# EAGLE design LDVBug_Hauptplatine (EAGLE 6.5.0)
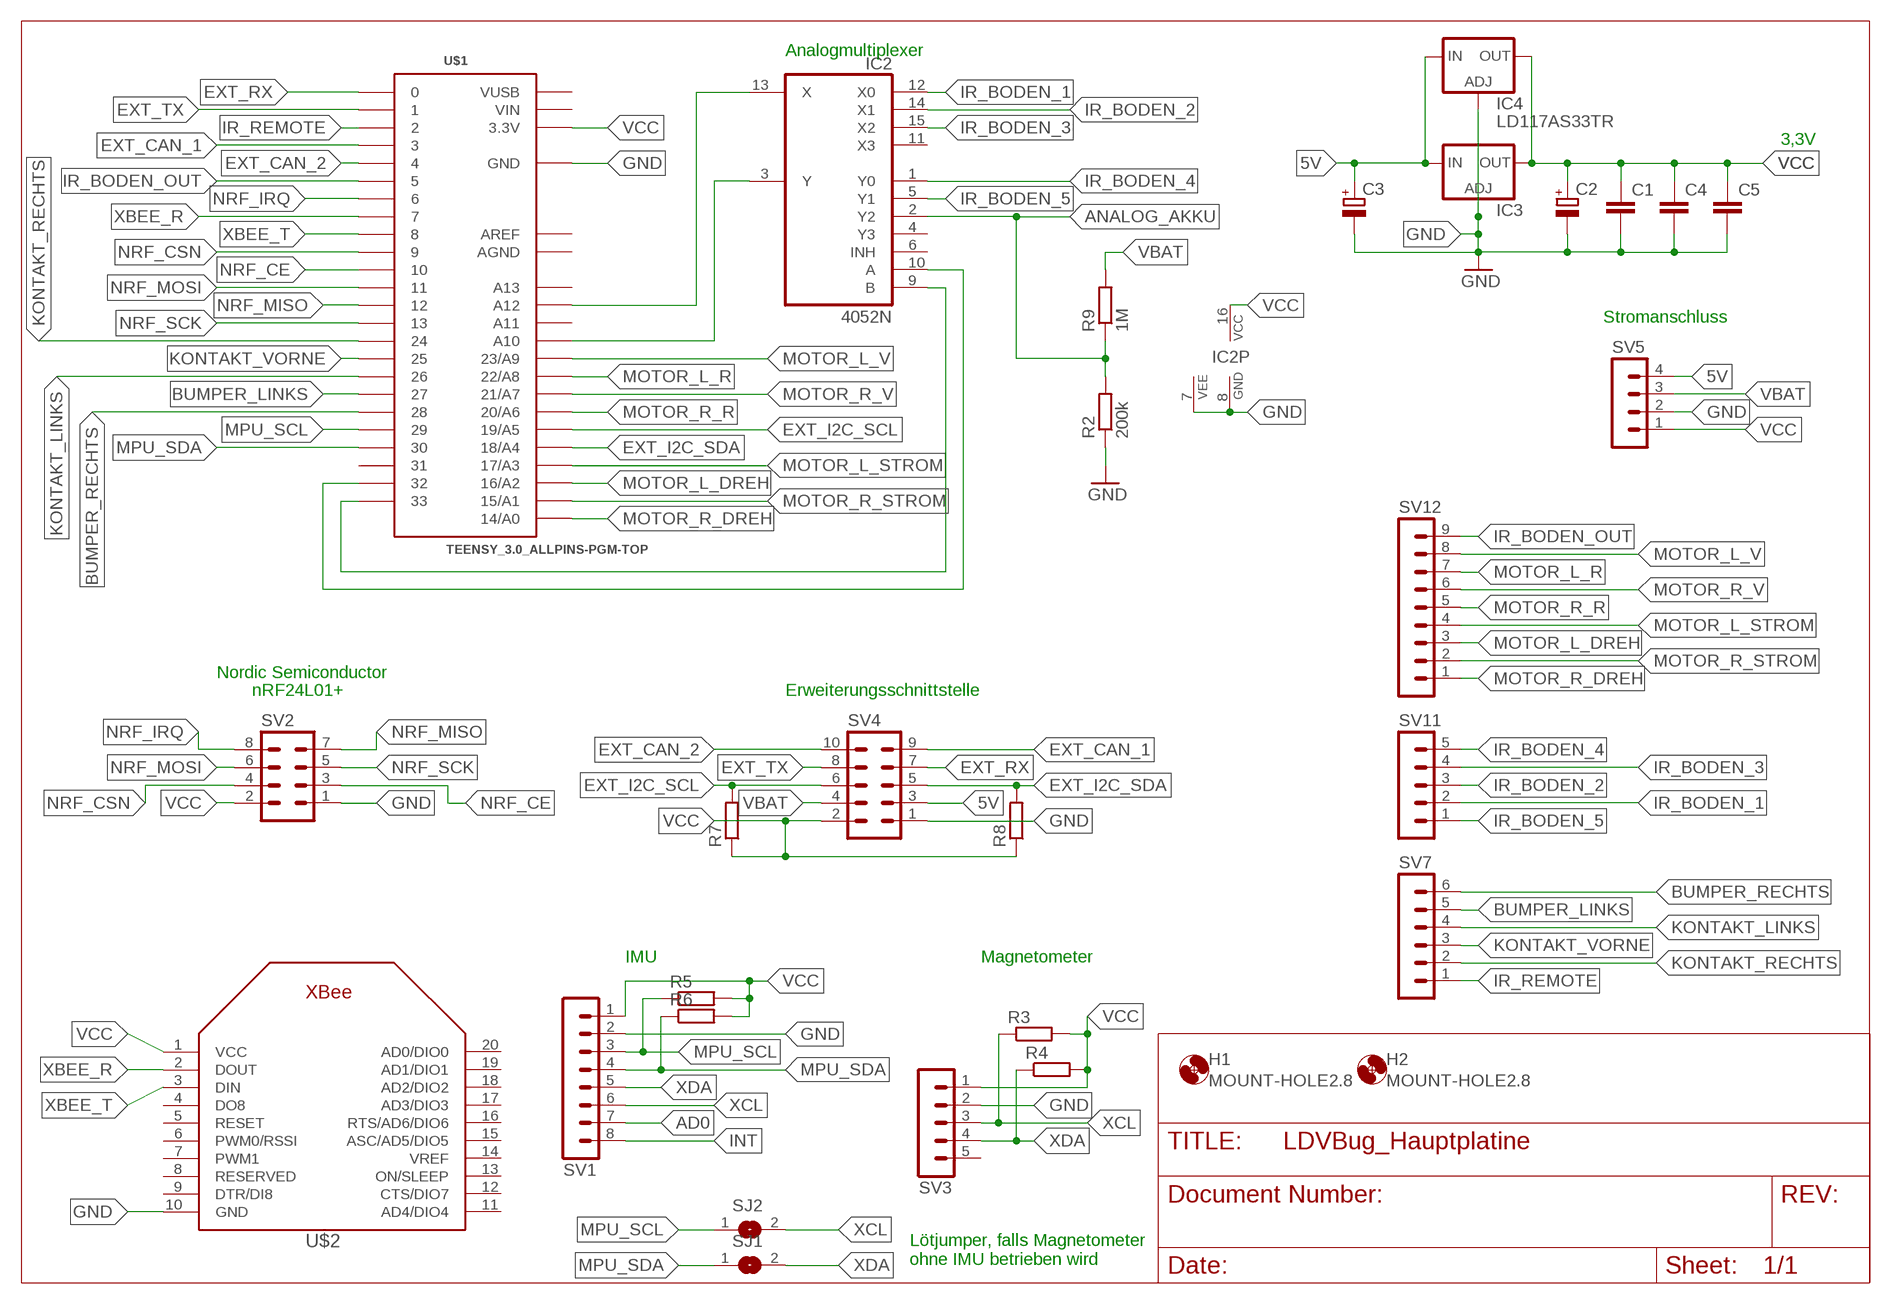
[diagram p0: schematic, sheet 1]

## Parts
C1  C-EU025-025X050  [C025-025X050]
C2  CPOL-EUE2.5-7  [E2,5-7]
C3  CPOL-EUE2.5-7  [E2,5-7]
C4  C-EU025-025X050  [C025-025X050]
C5  C-EU025-025X050  [C025-025X050]
H1  MOUNT-HOLE2.8  [2,8]
H2  MOUNT-HOLE2.8  [2,8]
IC2  4052N  [DIL16]
IC3  LM317TS  [317TS]
IC4  LD117AS33TR  [SOT223]
R2  200k  R-EU_0207/10  [0207/10]
R3  R-EU_R0805  [R0805]
R4  R-EU_R0805  [R0805]
R5  R-EU_R0805  [R0805]
R6  R-EU_R0805  [R0805]
R7  R-EU_R0805  [R0805]
R8  R-EU_R0805  [R0805]
R9  1M  R-EU_0207/18  [0207/15]
SJ1  SJ  [SJ]
SJ2  SJ  [SJ]
SV1  MA08-1  [MA08-1]
SV2  MA04-2  [MA04-2]
SV3  MA05-1  [MA05-1]
SV4  MA05-2  [MA05-2]
SV5  MA04-1  [MA04-1]
SV7  MA06-1  [MA06-1]
SV11  MA05-1  [MA05-1]
SV12  MA09-1  [MA09-1]
U$1  TEENSY_3.0_ALLPINS-PGM-TOP  [TEENSY_3.0_ALLPINS-PGM]
U$2  XBEE  [XBEE]

## Nets
5V: C3.+ IC3.3(IN) IC4.3(IN) SV4.3 SV5.4
AD0: SV1.7
ANALOG_AKKU: IC2.2(Y2) R2.2 R9.1
BUMPER_LINKS: SV7.5 U$1.27
BUMPER_RECHTS: SV7.6 U$1.28
EXT_CAN_1: SV4.9 U$1.3
EXT_CAN_2: SV4.10 U$1.4
EXT_I2C_SCL: R7.2 SV4.6 U$1.19/A5
EXT_I2C_SDA: R8.2 SV4.5 U$1.18/A4
EXT_RX: SV4.7 U$1.0
EXT_TX: SV4.8 U$1.1
GND: C1.2 C2.- C3.- C4.2 C5.2 IC2.7(VEE) IC2.8(GND) IC3.1(ADJ) IC4.1(ADJ) R2.1 SV1.2 SV2.1 SV3.2 SV4.1 SV5.2 U$1.GND U$1.GND2(GND) U$2.10(GND)
INT: SV1.8
IR_BODEN_1: IC2.12(X0) SV11.2
IR_BODEN_2: IC2.14(X1) SV11.3
IR_BODEN_3: IC2.15(X2) SV11.4
IR_BODEN_4: IC2.1(Y0) SV11.5
IR_BODEN_5: IC2.5(Y1) SV11.1
IR_BODEN_OUT: SV12.9 U$1.5
IR_REMOTE: SV7.1 U$1.2
KONTAKT_LINKS: SV7.4 U$1.26
KONTAKT_RECHTS: SV7.2 U$1.24
KONTAKT_VORNE: SV7.3 U$1.25
MOTOR_L_DREH: SV12.3 U$1.16/A2
MOTOR_L_R: SV12.7 U$1.22/A8
MOTOR_L_STROM: SV12.4 U$1.17/A3
MOTOR_L_V: SV12.8 U$1.23/A9
MOTOR_R_DREH: SV12.1 U$1.14/A0
MOTOR_R_R: SV12.5 U$1.20/A6
MOTOR_R_STROM: SV12.2 U$1.15/A1
MOTOR_R_V: SV12.6 U$1.21/A7
MPU_SCL: R5.1 SJ2.1 SV1.3 U$1.29
MPU_SDA: R6.1 SJ1.1 SV1.4 U$1.30
N$2: IC2.13(X) U$1.A12
N$3: IC2.3(Y) U$1.A10
N$4: IC2.9(B) U$1.33
N$5: IC2.10(A) U$1.32
NRF_CE: SV2.3 U$1.10
NRF_CSN: SV2.4 U$1.9
NRF_IRQ: SV2.8 U$1.6
NRF_MISO: SV2.7 U$1.12
NRF_MOSI: SV2.6 U$1.11
NRF_SCK: SV2.5 U$1.13
VBAT: R9.2 SV4.4 SV5.3
VCC: C1.1 C2.+ C4.1 C5.1 IC2.16(VCC) IC3.2(OUT) IC4.4(OUT) R3.2 R4.2 R5.2 R6.2 R7.1 R8.1 SV1.1 SV2.2 SV3.1 SV4.2 SV5.1 U$1.3.3V U$1.3.3V2(3.3V) U$2.1(VCC)
XBEE_R: U$1.7 U$2.2(DOUT)
XBEE_T: U$1.8 U$2.3(DIN)
XCL: R3.1 SJ2.2 SV1.6 SV3.3
XDA: R4.1 SJ1.2 SV1.5 SV3.4
Unconnected: IC2.4(Y3) IC2.6(INH) IC2.11(X3) SV3.5 U$1.31 U$1.A11 U$1.A13 U$2.4(DO8) U$2.5(RESET) U$2.6(PWM0/RSSI) U$2.7(PWM1) U$2.8(RESERVED) U$2.9(DTR/DI8) U$2.11(AD4/DIO4) U$2.12(CTS/DIO7) U$2.13(ON/SLEEP) U$2.14(VREF) U$2.15(ASC/AD5/DIO5) U$2.16(RTS/AD6/DIO6) U$2.17(AD3/DIO3) U$2.18(AD2/DIO2) U$2.19(AD1/DIO1) U$2.20(AD0/DIO0)

## Notes on the sheet
- Analogmultiplexer
- 3,3V
- Stromanschluss
- Nordic Semiconductor
- nRF24L01+ | Erweiterungsschnittstelle
- IMU | Magnetometer
- Lötjumper, falls Magnetometer
  ohne IMU betrieben wird

## Power pins joined to a net without a drawn wire
AGND: U$1.AGND
AREF: U$1.AREF
VIN: U$1.VIN
VUSB: U$1.VUSB

## Library data of the parts
C1 C4 C5 = resistor:C-EU: CAPACITOR, European symbol
C2 C3 = resistor:CPOL-EU: POLARIZED CAPACITOR, European symbol
H1 H2 = holes:MOUNT-HOLE: MOUNTING HOLE with drill center marker
IC2 = 40xx:4052: Dual 4-channel ANALOG MULTIPLEXER
IC3 = v-reg:LM317TS: VOLTAGE REGULATOR
IC4 = v-reg:LD117A?*: Low drop fixed and adjustable positive voltage regulators 1 A Source: http://www.st.com/stonline/products/literature/ds/7194/ld1117axx.pdf
R2-R8 = resistor:R-EU_: RESISTOR, European symbol
R9 = resistor_alex:R-EU_: RESISTOR, European symbol
SJ1 SJ2 = jumper:SJ: SMD solder JUMPER
SV1 = con-lstb:MA08-1: PIN HEADER; OC_FARNELL: unknown; OC_NEWARK: unknown
SV2 = con-lstb:MA04-2: PIN HEADER; OC_FARNELL: unknown; OC_NEWARK: unknown
SV3 SV11 = con-lstb:MA05-1: PIN HEADER; OC_FARNELL: unknown; OC_NEWARK: unknown
SV4 = con-lstb:MA05-2: PIN HEADER; OC_FARNELL: unknown; OC_NEWARK: unknown
SV5 = con-lstb:MA04-1: PIN HEADER; OC_FARNELL: unknown; OC_NEWARK: unknown
SV7 = con-lstb:MA06-1: PIN HEADER; OC_FARNELL: unknown; OC_NEWARK: unknown
SV12 = con-lstb:MA09-1: PIN HEADER; OC_FARNELL: unknown; OC_NEWARK: unknown
U$1 = Teensy3.1:TEENSY_3.0_ALLPINS-PGM-TOP: Teensy 3.0 board outline with all pins and pads enabled except 'PGM' pin. For more basic versions, see 'Basic', '+4', and 'AllAnalogPins'. Requires the installation of a un-shrouded SMD header on the underside of the Teensy 3.0
U$2 = adafruit:XBEE

## Board
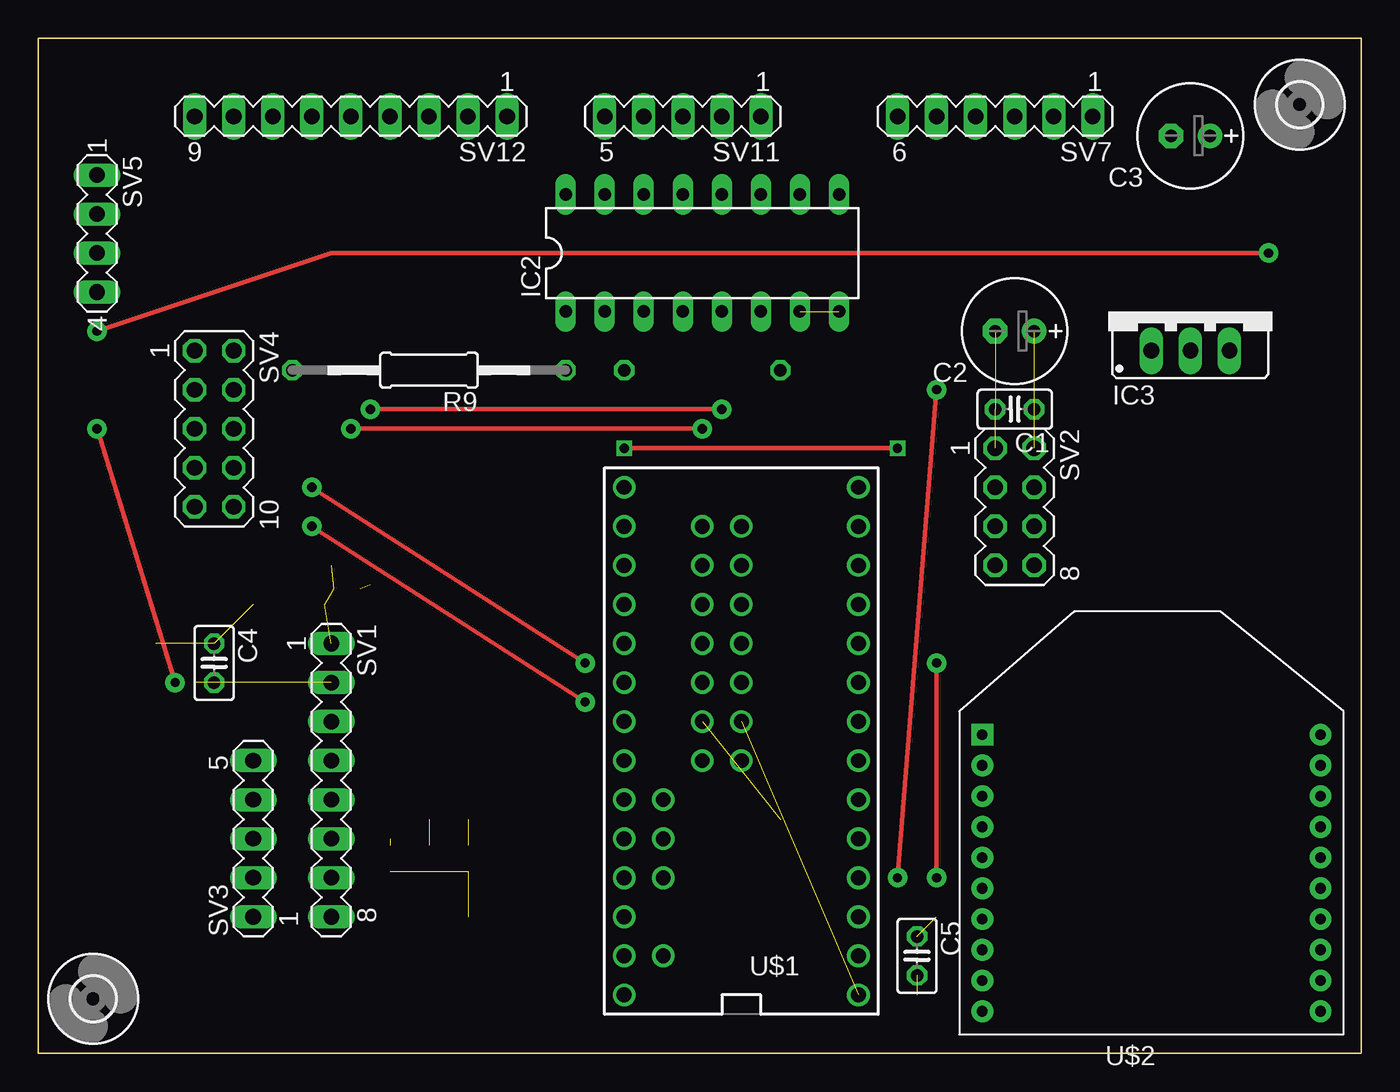
[diagram p1: board, top side]
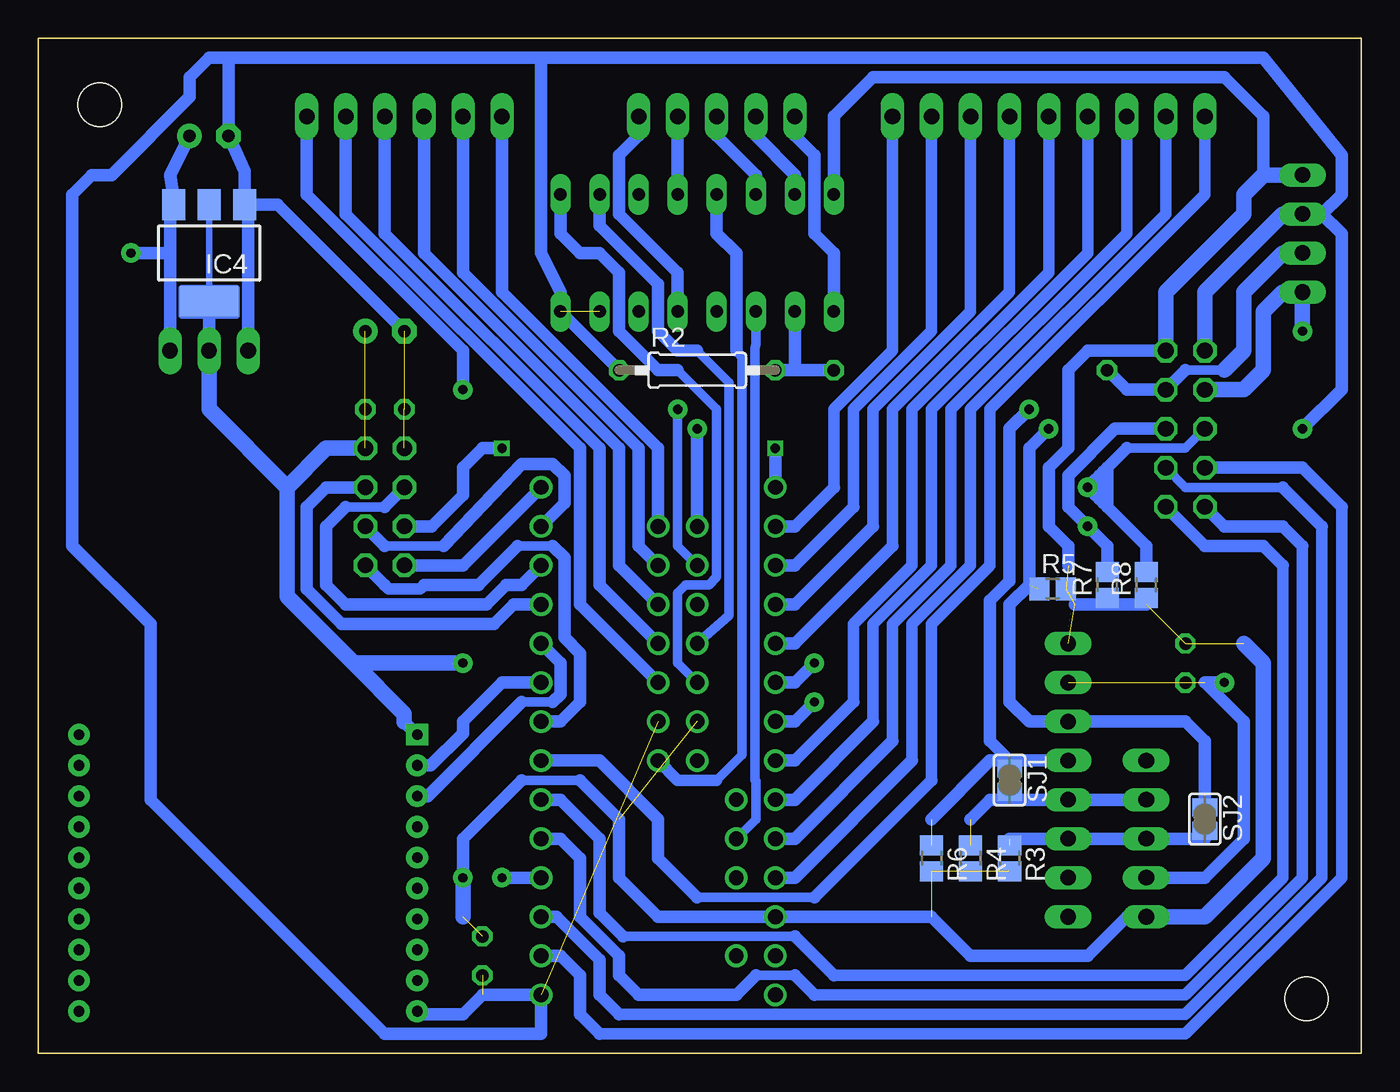
[diagram p2: board, bottom side, seen from below]

Size 86.03 x 66.03 mm. Coordinates in mm from the lower left corner, seen from the top.
Outline: 0,0 86.03,0 86.03,66.03 0,66.03 0,0
Copper layers (1*16): Top 0.035mm / dielectric 1.5mm / Bottom 0.035mm
Design rules "default": minimum track width 10mil, minimum drill 24mil, track to track 8mil, track to pad 8mil, pad to pad 8mil, via to via 8mil, smd to smd 8mil, copper to edge 40mil, drill to drill 8mil, minimum pad ring 10mil, minimum via ring 8mil, stop-mask expansion 4mil, vias tented up to drill 0mil, thermal gap 10mil
bRestrict: area 32.3,49.3 to 32.8,49.8

### Footprints (pad centres in the part's own frame; a part is rotated, then mirrored left to right if it is on the bottom)
C025-025X050 = drill 0.813 octagon: 1 -1.27,0; 2 1.27,0
E2,5-7 = drill 0.813 pad 1.6: + -1.27,0 | drill 0.813 pad 1.6 octagon: - 1.27,0
2,8 = hole 2.8: 0,0
DIL16 = drill 0.813 long: 1 -8.89,-3.81; 2 -6.35,-3.81; 3 -3.81,-3.81; 4 -1.27,-3.81; 5 1.27,-3.81; 6 3.81,-3.81; 7 6.35,-3.81; 8 8.89,-3.81; 9 8.89,3.81; 10 6.35,3.81; 11 3.81,3.81; 12 1.27,3.81; 13 -1.27,3.81; 14 -3.81,3.81; 15 -6.35,3.81; 16 -8.89,3.81
317TS = drill 1.016 long: 1 -2.54,-2.54; 2 0,-2.54; 3 2.54,-2.54
SOT223 = smd 1.5 x 2: 1 -2.3,-3.15; 2 0,-3.15; 3 2.3,-3.15 | smd 3.8 x 2: 4 0,3.15
0207/10 = drill 0.813 octagon: 1 -5.08,0; 2 5.08,0
R0805 = smd 1.3 x 1.5: 1 -0.85,0; 2 0.85,0
0207/15 = drill 0.813 octagon: 1 -8.89,0; 2 8.89,0
SJ = smd 1.168 x 1.6: 1 -0.762,0; 2 0.762,0
MA08-1 = drill 1.016 long: 1 -8.89,0; 2 -6.35,0; 3 -3.81,0; 4 -1.27,0; 5 1.27,0; 6 3.81,0; 7 6.35,0; 8 8.89,0
MA04-2 = drill 1.016 octagon: 1 -3.81,-1.27; 2 -3.81,1.27; 3 -1.27,-1.27; 4 -1.27,1.27; 5 1.27,-1.27; 6 1.27,1.27; 7 3.81,-1.27; 8 3.81,1.27
MA05-1 = drill 1.016 long: 1 -5.08,0; 2 -2.54,0; 3 0,0; 4 2.54,0; 5 5.08,0
MA05-2 = drill 1.016 octagon: 1 -5.08,-1.27; 2 -5.08,1.27; 3 -2.54,-1.27; 4 -2.54,1.27; 5 0,-1.27; 6 0,1.27; 7 2.54,-1.27; 8 2.54,1.27; 9 5.08,-1.27; 10 5.08,1.27
MA04-1 = drill 1.016 long: 1 -3.81,0; 2 -1.27,0; 3 1.27,0; 4 3.81,0
MA06-1 = drill 1.016 long: 1 -6.35,0; 2 -3.81,0; 3 -1.27,0; 4 1.27,0; 5 3.81,0; 6 6.35,0
MA09-1 = drill 1.016 long: 1 -10.16,0; 2 -7.62,0; 3 -5.08,0; 4 -2.54,0; 5 0,0; 6 2.54,0; 7 5.08,0; 8 7.62,0; 9 10.16,0
TEENSY_3.0_ALLPINS-PGM = drill 0.965: 0 -6.35,16.51; 1 -6.35,13.97; 2 -6.35,11.43; 3 -6.35,8.89; 3.3V 8.89,13.97; 3.3V2 3.81,1.27; 4 -6.35,6.35; 5 -6.35,3.81; 6 -6.35,1.27; 7 -6.35,-1.27; 8 -6.35,-3.81; 9 -6.35,-6.35; 10 -6.35,-8.89; 11 -6.35,-11.43; 12 -6.35,-13.97; 13 8.89,-13.97; 14/A0 8.89,-11.43; 15/A1 8.89,-8.89; 16/A2 8.89,-6.35; 17/A3 8.89,-3.81; 18/A4 8.89,-1.27; 19/A5 8.89,1.27; 20/A6 8.89,3.81; 21/A7 8.89,6.35; 22/A8 8.89,8.89; 23/A9 8.89,11.43; 24 1.27,-1.27; 25 1.27,-3.81; 26 1.27,-6.35; 27 1.27,-8.89; 28 1.27,-11.43; 29 3.81,-11.43; 30 3.81,-8.89; 31 3.81,-6.35; 32 3.81,-3.81; 33 3.81,-1.27; A10 6.35,8.89; A11 6.35,6.35; A12 1.27,3.81; A13 3.81,3.81; AGND 8.89,16.51; AREF 6.35,11.43; GND -6.35,19.05; GND2 1.27,1.27; VIN 8.89,19.05; VUSB 6.35,16.51
XBEE = drill 0.7 pad 1.422 square: 1 -11,5.5 | drill 0.7 pad 1.422: 2 -11,3.5; 3 -11,1.5; 4 -11,-0.5; 5 -11,-2.5; 6 -11,-4.5; 7 -11,-6.5; 8 -11,-8.5; 9 -11,-10.5; 10 -11,-12.5; 11 11,-12.5; 12 11,-10.5; 13 11,-8.5; 14 11,-6.5; 15 11,-4.5; 16 11,-2.5; 17 11,-0.5; 18 11,1.5; 19 11,3.5; 20 11,5.5

### Placement (x,y rotation side)
C1  63.5,41.91 180 top
C2  63.5,46.99 180 top
C3  74.93,59.69 180 top
C4  11.43,25.4 270 top
C5  57.15,6.35 270 top
H1  82.04,61.72 0 top
H2  3.56,3.56 0 top
IC2  43.18,52.07 0 top
IC3  74.93,48.26 0 top
IC4  74.93,52.07 180 bottom
R2  43.18,44.45 0 bottom
R3  22.86,12.7 270 bottom
R4  25.4,12.7 270 bottom
R5  20.07,30.23 0 bottom
R6  27.94,12.7 270 bottom
R7  16.51,30.48 90 bottom
R8  13.97,30.48 90 bottom
R9  25.4,44.45 180 top
SJ1  22.86,17.78 270 bottom
SJ2  10.16,15.24 270 bottom
SV1  19.05,17.78 270 top
SV2  63.5,35.56 270 top
SV3  13.97,13.97 90 top
SV4  11.43,40.64 270 top
SV5  3.81,53.34 270 top
SV7  62.23,60.96 180 top
SV11  41.91,60.96 180 top
SV12  20.32,60.96 180 top
U$1  46.99,22.86 180 top
U$2  72.39,15.24 0 top

### Tracks (layer width: path | path; a pad name or v marks a point on that pad's centre or on a via)
5V  (via drill 0.6 pad 1.27)
  Top 0.305: v3.81,46.99 19.05,52.07 v80.01,52.07
  Bottom 0.813: IC3.3 77.47,52.07 | 77.47,52.07 77.47,54.98 IC4.3 77.23,55.64 77.47,57.15 C3.+ | SV4.3 8.89,43.18 | v80.01,52.07 77.47,52.07
  Bottom 1.016: SV4.3 7.62,43.18 6.35,44.45 6.35,48.26 5.08,49.53 SV5.4 v3.81,46.99
ANALOG_AKKU
  Bottom 0.813: IC2.2 36.83,44.45 R2.2 R9.1
BUMPER_LINKS
  Bottom 0.762: 46.99,39.37 58.42,50.8
  Bottom 0.813: U$1.27 46.99,33.02 46.99,39.37 | 58.42,50.8 SV7.5
BUMPER_RECHTS
  Bottom 0.762: 45.72,39.37 55.88,49.53
  Bottom 0.813: U$1.28 45.72,39.37 | 55.88,49.53 SV7.6
EXT_CAN_1
  Bottom 0.61: 39.37,5.08 36.83,5.08
  Bottom 0.762: 35.56,3.81 11.43,3.81 3.81,11.43 3.81,33.02
  Bottom 0.813: U$1.3 52.07,13.97 50.8,12.7 50.8,8.89 48.26,6.35 48.26,5.08 46.99,3.81 40.64,3.81 39.37,5.08 | 36.83,5.08 35.56,3.81 | 3.81,33.02 5.08,34.29 8.89,34.29 SV4.9
EXT_CAN_2
  Bottom 0.61: 48.01,7.62 36.83,7.62
  Bottom 0.762: 34.29,5.08 11.43,5.08 5.08,11.43 5.08,31.75
  Bottom 0.813: U$1.4 52.07,16.51 49.53,13.97 49.53,9.14 48.01,7.62 | 36.83,7.62 34.29,5.08 | 5.08,31.75 6.35,33.02 10.16,33.02 SV4.10
EXT_I2C_SCL  (via drill 0.6 pad 1.27)
  Top 0.305: v35.56,22.86 v17.78,34.29
  Bottom 0.813: SV4.6 16,40.64 19.05,37.59 19.05,35.56 v17.78,34.29 16.51,33.02 R7.2 | U$1.19/A5 36.83,21.59 v35.56,22.86
EXT_I2C_SDA  (via drill 0.6 pad 1.27)
  Top 0.305: v35.56,25.4 v17.78,36.83
  Bottom 0.61: SV4.5 11.43,39.37 15.24,39.37
  Bottom 0.813: R8.2 13.97,33.02 16.51,35.56 | 17.27,36.32 17.27,37.34 | 17.27,37.34 17.02,37.59 | 17.02,37.59 17.02,36.07 | 16.76,35.81 16.76,37.85 | 16.51,38.1 16.51,35.56 | 16.51,35.56 16.76,35.81 | 16.76,35.81 17.02,36.07 | 17.02,36.07 17.27,36.32 | 17.27,36.32 v17.78,36.83 17.27,37.34 | 17.02,37.59 16.76,37.85 | 16.76,37.85 16.51,38.1 | 16.51,38.1 15.24,39.37 | U$1.18/A4 36.83,24.13 v35.56,25.4
EXT_RX
  Bottom 0.762: 49.53,1.27 11.43,1.27 1.27,11.43 1.27,35.56
  Bottom 0.813: U$1.0 52.07,6.35 50.8,5.08 50.8,2.54 49.53,1.27 | 1.27,35.56 3.81,38.1 SV4.7
EXT_TX
  Bottom 0.61: 5.08,36.83 11.43,36.83 SV4.8
  Bottom 0.762: 48.26,2.54 11.43,2.54 2.54,11.43 2.54,34.29
  Bottom 0.813: U$1.1 52.32,8.89 49.53,6.1 49.53,3.81 48.26,2.54 | 2.54,34.29 5.08,36.83
GND  (via drill 0.6 pad 1.27)  (7 unrouted)
  Top 0.305: v8.89,24.13 v3.81,40.64
  Bottom 0.813: SV3.2 10.16,11.43 7.62,13.97 7.62,21.59 10.16,24.13 v8.89,24.13 | 73.66,64.77 74.93,64.77 76.2,63.5 76.2,62.23 81.28,57.15 82.55,57.15 83.82,55.88 83.82,33.02 78.74,27.94 78.74,16.51 63.5,1.27 53.34,1.27 U$1.GND 57.15,3.81 58.42,2.54 60.96,2.54 61.16,2.74 U$2.10 | 73.66,64.77 53.34,64.77 | 53.34,64.77 6.35,64.77 1.27,58.42 1.27,55.88 2.54,54.61 | 53.34,64.77 53.34,52.07 52.07,49.53 IC2.8 R2.1 | SV5.2 2.54,54.61 | C2.- 70.46,55.22 IC4.1 | IC4.1 72.63,57.39 C3.- 73.66,64.77 | IC3.1 72.39,54.98 IC4.1 | v3.81,40.64 1.27,43.18 1.27,53.34 2.54,54.61
  Bottom 1.016: SV4.1 10.16,49.53 5.08,54.61 SV5.2
IR_BODEN_1
  Bottom 0.813: IC2.12 SV11.2
IR_BODEN_2
  Bottom 0.813: IC2.14 39.37,57.15 41.91,59.69 SV11.3
IR_BODEN_3
  Bottom 0.813: IC2.15 36.83,57.15 39.37,59.69 SV11.4
IR_BODEN_4
  Bottom 0.813: IC2.1 34.29,52.07 35.56,53.34 35.56,58.42 36.83,59.69 SV11.5
IR_BODEN_5
  Bottom 0.813: IC2.5 44.45,50.8 48.26,54.61 48.26,58.42 46.99,59.69 SV11.1
IR_BODEN_OUT
  Bottom 0.61: 43.18,10.16 35.56,10.16
  Bottom 0.762: 27.94,17.78 27.94,27.94 24.13,31.75 24.13,41.91 10.16,55.88 SV12.9
  Bottom 0.813: U$1.5 49.53,19.05 45.72,15.24 45.72,12.7 43.18,10.16 | 35.56,10.16 27.94,17.78
IR_REMOTE  (via drill 0.6 pad 1.27)
  Top 0.305: v55.88,11.43 v58.42,43.18
  Bottom 0.813: U$1.2 v55.88,11.43 | v58.42,43.18 58.42,45.72 68.58,55.88 SV7.1
KONTAKT_LINKS
  Bottom 0.762: 48.26,39.37 60.96,52.07
  Bottom 0.813: U$1.26 48.26,31.75 48.26,39.37 | 60.96,52.07 SV7.4
KONTAKT_RECHTS
  Bottom 0.762: 50.8,39.37 66.04,54.61
  Bottom 0.813: U$1.24 50.8,29.21 50.8,39.37 | 66.04,54.61 SV7.2
KONTAKT_VORNE
  Bottom 0.762: 49.53,39.37 63.5,53.34
  Bottom 0.813: U$1.25 49.53,30.48 49.53,39.37 | 63.5,53.34 SV7.3
MOTOR_L_DREH
  Bottom 0.762: 31.75,34.29 31.75,41.91 25.4,48.26 SV12.3
  Bottom 0.813: U$1.16/A2 36.83,29.21 31.75,34.29
MOTOR_L_R
  Bottom 0.762: 30.48,20.32 30.48,27.94 26.67,31.75 26.67,41.91 15.24,53.34 SV12.7
  Bottom 0.813: U$1.22/A8 36.83,13.97 30.48,20.32
MOTOR_L_STROM
  Bottom 0.762: 30.48,33.02 30.48,41.91 22.86,49.53 SV12.4
  Bottom 0.813: U$1.17/A3 36.83,26.67 30.48,33.02
MOTOR_L_V
  Bottom 0.762: 29.21,19.05 29.21,27.94 25.4,31.75 25.4,41.91 12.7,54.61 SV12.8
  Bottom 0.813: U$1.23/A9 36.83,11.43 29.21,19.05
MOTOR_R_DREH
  Bottom 0.762: 34.29,36.83 34.29,41.91 30.48,45.72 SV12.1
  Bottom 0.813: U$1.14/A0 36.83,34.29 34.29,36.83
MOTOR_R_R
  Bottom 0.762: 33.02,22.86 33.02,27.94 29.21,31.75 29.21,41.91 20.32,50.8 SV12.5
  Bottom 0.813: U$1.20/A6 36.83,19.05 33.02,22.86
MOTOR_R_STROM
  Bottom 0.762: 33.02,35.56 33.02,41.91 27.94,46.99 SV12.2
  Bottom 0.813: U$1.15/A1 36.83,31.75 33.02,35.56
MOTOR_R_V
  Bottom 0.762: 31.75,21.59 31.75,27.94 27.94,31.75 27.94,41.91 17.78,52.07 SV12.6
  Bottom 0.813: U$1.21/A7 36.83,16.51 31.75,21.59
MPU_SCL  (via drill 0.6 pad 1.27)  (1 unrouted)
  Top 0.305: v20.32,40.64 v43.18,40.64
  Bottom 0.813: U$1.29 v43.18,40.64 | v20.32,40.64 21.59,39.37 21.59,30.48 22.86,29.21 22.86,22.86 21.59,21.59 SV1.3 11.43,21.59 10.16,20.32 SJ2.1
MPU_SDA  (via drill 0.6 pad 1.27)  (1 unrouted)
  Top 0.305: v44.45,41.91 v21.59,41.91
  Bottom 0.61: U$1.30 44.45,33.02 v44.45,41.91
  Bottom 0.813: v21.59,41.91 22.86,40.64 22.86,30.73 24.13,29.46 24.13,20.32 22.86,19.05 | 22.86,19.05 SV1.4 | SJ1.1 22.86,19.05 | 22.86,19.05 24.13,19.05 27.94,15.24
N$2
  Bottom 0.61: 41.91,17.78 40.26,19.43 40.26,45.24 40.64,45.72
  Bottom 0.762: U$1.A12 44.45,17.78 41.91,17.78
  Bottom 0.813: 40.64,45.72 40.64,52.07 41.91,53.34 IC2.13
N$3
  Bottom 0.61: IC2.3 39.37,46.15 39.42,45.9 39.42,17.78 39.37,17.73 39.37,15.24 U$1.A10
N$4
  Bottom 0.61: U$1.33 44.45,25.4 44.45,29.97 43.94,30.48 42.42,30.48 41.91,30.99 41.91,41.91 44.45,44.45
  Bottom 0.813: IC2.9 52.07,53.34 50.8,52.07 49.53,52.07 48.26,50.8 48.26,46.99 45.72,44.45 44.45,44.45
N$5
  Bottom 0.61: U$1.32 41.1,28.5 41.1,43.64 43.18,45.72
  Bottom 0.813: IC2.10 49.53,53.85 45.72,50.04 45.72,46.99 44.45,45.72 43.18,45.72
NRF_CE
  Bottom 0.61: 63.5,35.56 66.04,35.56
  Bottom 0.813: SV2.3 63.5,35.56 | 66.04,35.56 67.31,34.29 67.31,30.48 66.04,29.21 56.9,29.21 55.63,30.48 54.61,30.48 U$1.10
NRF_CSN
  Bottom 0.813: SV2.4 67.31,36.83 68.58,35.56 68.58,30.23 66.29,27.94 56.39,27.94 55.12,29.21 U$1.9
NRF_IRQ
  Bottom 0.61: 54.86,33.02 52.58,33.02
  Bottom 0.762: 63.5,30.48 63.25,30.23 61.21,30.23 60.96,30.48
  Bottom 0.813: SV2.8 63.5,30.48 | 60.96,30.48 57.4,30.48 54.86,33.02 | 52.58,33.02 51.82,32.26 51.82,27.05 50.8,26.04 50.8,22.86 52.07,21.59 U$1.6
NRF_MISO
  Bottom 0.813: U$1.12 58.42,31.75 SV2.7
NRF_MOSI
  Bottom 0.61: 63.5,33.02 59.69,33.02
  Bottom 0.813: SV2.6 63.5,33.02 | U$1.11 51.82,35.81 51.82,37.59 52.58,38.35 54.61,38.35 59.69,33.02
NRF_SCK  (via drill 0.6)
  Top 0.305: v38.1,39.37 v55.88,39.37
  Bottom 0.813: SV2.5 60.45,34.29 58.42,36.32 58.42,38.1 57.15,39.37 v55.88,39.37 | v38.1,39.37 U$1.13
VBAT
  Bottom 0.61: 8.89,44.45 11.43,44.45
  Bottom 0.813: 11.43,44.45 SV4.4 15.24,43.18 R9.2
  Bottom 1.016: 8.89,44.45 7.62,45.72 7.62,49.53 5.08,52.07 SV5.3
VCC  (via drill 0.6 pad 1.27)  (12 unrouted)
  Top 0.305: v58.42,11.43 v58.42,25.4
  Bottom 0.406: 74.93,48.26 74.93,55.88 | 74.93,48.01 73.15,48.01 73.15,49.78 76.71,49.78 76.71,48.01 74.93,48.01
  Bottom 0.61: 50.8,17.78 54.61,17.78
  Bottom 0.813: 62.23,21.58 U$2.1 | SV3.1 15.24,8.89 17.78,6.35 22.86,6.35 25.4,6.35 27.94,8.89 U$1.3.3V 45.72,8.89 48.26,11.43 48.26,15.24 50.8,17.78 | 16.51,29.21 18.63,29.21 | R7.1 16.51,29.21 | 16.51,29.21 13.97,29.21 R8.1 | IC2.16 34.29,60.96 31.75,63.5 8.89,63.5 6.35,60.96 6.35,57.15 | IC3.2 74.93,48.01 74.93,48.26 IC4.4 | 54.61,17.78 58.42,13.97 v58.42,11.43 | 19.05,31.75 19.05,33.02 20.32,34.29 20.32,38.1 19.05,39.37 19.05,44.45 17.78,45.72 SV4.2
  Bottom 1.016: SV3.1 10.16,8.89 6.35,12.7 6.35,25.4 7.62,26.67 | SV2.2 67.31,39.37 69.85,36.83 | 69.85,36.83 69.85,29.72 65.53,25.4 | 65.53,25.4 62.23,22.1 62.23,21.58 | SV4.2 12.7,49.53 7.62,54.61 7.62,55.88 6.35,57.15 SV5.1 | IC3.2 74.93,41.91 69.85,36.83 | v58.42,11.43 58.42,8.89 | v58.42,25.4 65.53,25.4
XBEE_R
  Bottom 0.813: U$2.2 60.51,18.74 58.42,20.83 58.42,21.59 55.88,24.13 U$1.7
XBEE_T
  Bottom 0.61: 54.61,22.86 52.58,22.86
  Bottom 0.813: 54.61,22.86 60.73,16.74 U$2.3 | 52.58,22.86 52.07,23.37 52.07,25.4 U$1.8
XCL  (1 unrouted)
  Bottom 0.813: SJ2.2 10.16,13.97 SV3.3 SV1.6 22.86,13.97
XDA  (1 unrouted)
  Bottom 0.813: SV3.4 SV1.5 22.86,16.51 | SJ1.2 22.86,16.51 | 25.4,15.24 24.13,16.51 22.86,16.51